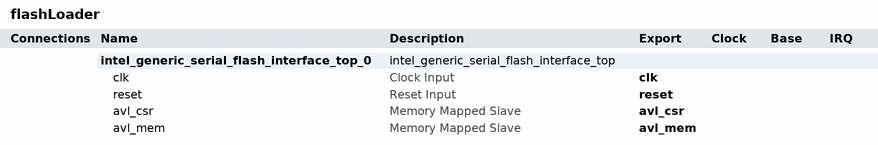
[diagram p0: system contents]
# Platform Designer (Qsys) system flashLoader, Cyclone IV E EP4CE22F17C6
# Parameters at their usual value, and those the tool derives, are not listed.
package require qsys
create_system flashLoader
set_project_property DEVICE_FAMILY {Cyclone IV E}
set_project_property DEVICE EP4CE22F17C6

add_instance intel_generic_serial_flash_interface_top_0 intel_generic_serial_flash_interface_top 18.0
set_instance_property intel_generic_serial_flash_interface_top_0 AUTO_EXPORT true
set_instance_parameter_value intel_generic_serial_flash_interface_top_0 CHIP_SELECT_BYPASS false
set_instance_parameter_value intel_generic_serial_flash_interface_top_0 CHIP_SELS 1
set_instance_parameter_value intel_generic_serial_flash_interface_top_0 DEBUG_OPTION 0
set_instance_parameter_value intel_generic_serial_flash_interface_top_0 DEFAULT_VALUE_REG_0 1
set_instance_parameter_value intel_generic_serial_flash_interface_top_0 DEFAULT_VALUE_REG_1 16
set_instance_parameter_value intel_generic_serial_flash_interface_top_0 DEFAULT_VALUE_REG_2 0
set_instance_parameter_value intel_generic_serial_flash_interface_top_0 DEFAULT_VALUE_REG_3 0
set_instance_parameter_value intel_generic_serial_flash_interface_top_0 DEFAULT_VALUE_REG_4 0
set_instance_parameter_value intel_generic_serial_flash_interface_top_0 DEFAULT_VALUE_REG_5 3
set_instance_parameter_value intel_generic_serial_flash_interface_top_0 DEFAULT_VALUE_REG_6 28674
set_instance_parameter_value intel_generic_serial_flash_interface_top_0 DEFAULT_VALUE_REG_7 6149
set_instance_parameter_value intel_generic_serial_flash_interface_top_0 DEVICE_DENSITY 64
set_instance_parameter_value intel_generic_serial_flash_interface_top_0 ENABLE_SIM_MODEL true
set_instance_parameter_value intel_generic_serial_flash_interface_top_0 PIPE_CMD_GEN_CMD 0
set_instance_parameter_value intel_generic_serial_flash_interface_top_0 PIPE_CSR 0
set_instance_parameter_value intel_generic_serial_flash_interface_top_0 PIPE_MUX_CMD 0
set_instance_parameter_value intel_generic_serial_flash_interface_top_0 PIPE_XIP 0
set_instance_parameter_value intel_generic_serial_flash_interface_top_0 USE_CHIP_SEL_FROM_CSR 1
set_instance_parameter_value intel_generic_serial_flash_interface_top_0 gui_use_asmiblock false
set_instance_parameter_value intel_generic_serial_flash_interface_top_0 gui_use_gpio false

# exported interfaces
add_interface avl_csr avalon slave
set_interface_property avl_csr EXPORT_OF intel_generic_serial_flash_interface_top_0.avl_csr
add_interface avl_mem avalon slave
set_interface_property avl_mem EXPORT_OF intel_generic_serial_flash_interface_top_0.avl_mem
add_interface clk clock sink
set_interface_property clk EXPORT_OF intel_generic_serial_flash_interface_top_0.clk
add_interface reset reset sink
set_interface_property reset EXPORT_OF intel_generic_serial_flash_interface_top_0.reset

set_interconnect_requirement {$system} qsys_mm.clockCrossingAdapter HANDSHAKE
set_interconnect_requirement {$system} qsys_mm.enableEccProtection FALSE
set_interconnect_requirement {$system} qsys_mm.insertDefaultSlave FALSE
set_interconnect_requirement {$system} qsys_mm.maxAdditionalLatency 1

save_system flashLoader.qsys
